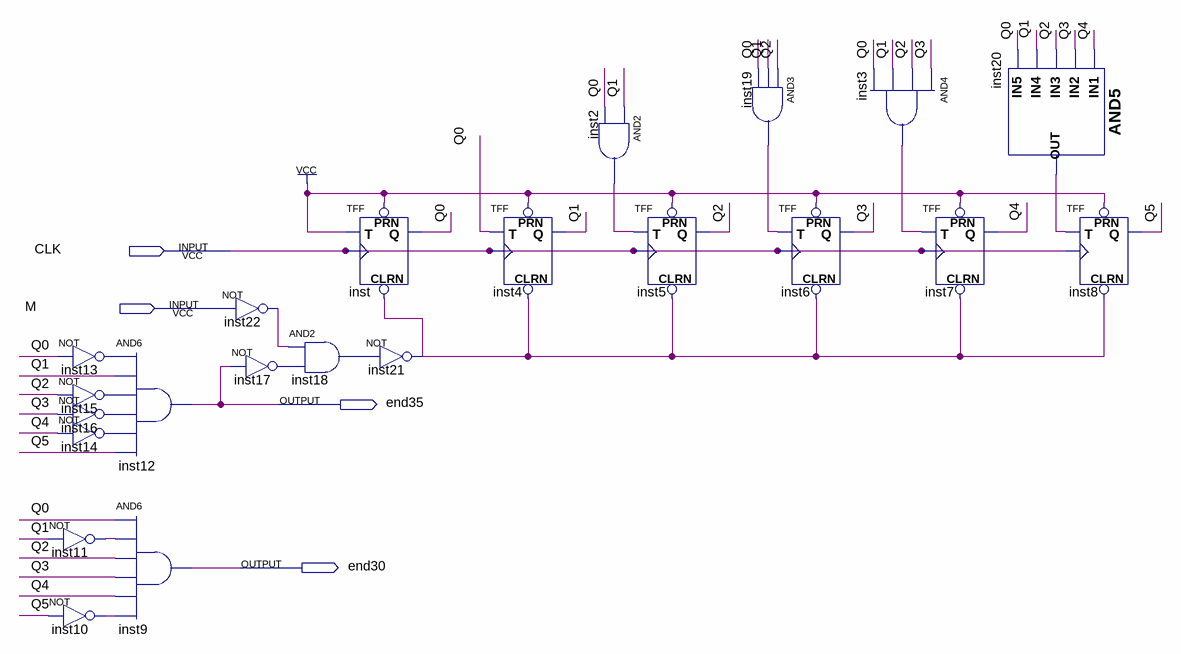
[diagram p0: schematic sheet]
// Quartus schematic contador.bdf as structural Verilog: 22 symbols, 4 pins
module contador (
  input  CLK,
  input  M,
  output end35,
  output end30
);

  wire inst2_out, inst3_out, inst10_out, inst11_out, inst13_out, inst14_out, inst15_out, inst16_out,
       inst17_out, inst18_out, inst19_out, inst20_out, inst21_out, inst22_out, Q0, Q1, Q2, Q3, Q4, Q5;

  not inst13 (inst13_out, Q0);
  not inst15 (inst15_out, Q2);
  not inst16 (inst16_out, Q3);
  not inst14 (inst14_out, Q4);
  not inst11 (inst11_out, Q1);
  not inst10 (inst10_out, Q5);
  and inst12 (end35, inst13_out, Q1, inst15_out, inst16_out, inst14_out, Q5);
  and inst9 (end30, Q0, inst11_out, Q2, Q3, Q4, inst10_out);
  not inst22 (inst22_out, M);
  not inst17 (inst17_out, end35);
  and inst18 (inst18_out, inst22_out, inst17_out);
  TFF inst (.PRN(1'b1), .CLRN(inst21_out), .T(1'b1), .CLK(CLK), .Q(Q0));
  not inst21 (inst21_out, inst18_out);
  TFF inst4 (.PRN(1'b1), .CLRN(inst21_out), .T(Q0), .CLK(CLK), .Q(Q1));
  and inst2 (inst2_out, Q1, Q0);
  TFF inst5 (.PRN(1'b1), .CLRN(inst21_out), .T(inst2_out), .CLK(CLK), .Q(Q2));
  and inst19 (inst19_out, Q2, Q1, Q0);
  TFF inst6 (.PRN(1'b1), .CLRN(inst21_out), .T(inst19_out), .CLK(CLK), .Q(Q3));
  and inst3 (inst3_out, Q3, Q2, Q1, Q0);
  TFF inst7 (.PRN(1'b1), .CLRN(inst21_out), .T(inst3_out), .CLK(CLK), .Q(Q4));
  and inst20 (inst20_out, Q4, Q3, Q2, Q1, Q0);
  TFF inst8 (.PRN(1'b1), .CLRN(inst21_out), .T(inst20_out), .CLK(CLK), .Q(Q5));
endmodule
